# Altium schematic sheet Digital_Test.SchDoc
size 381 x 241 mm
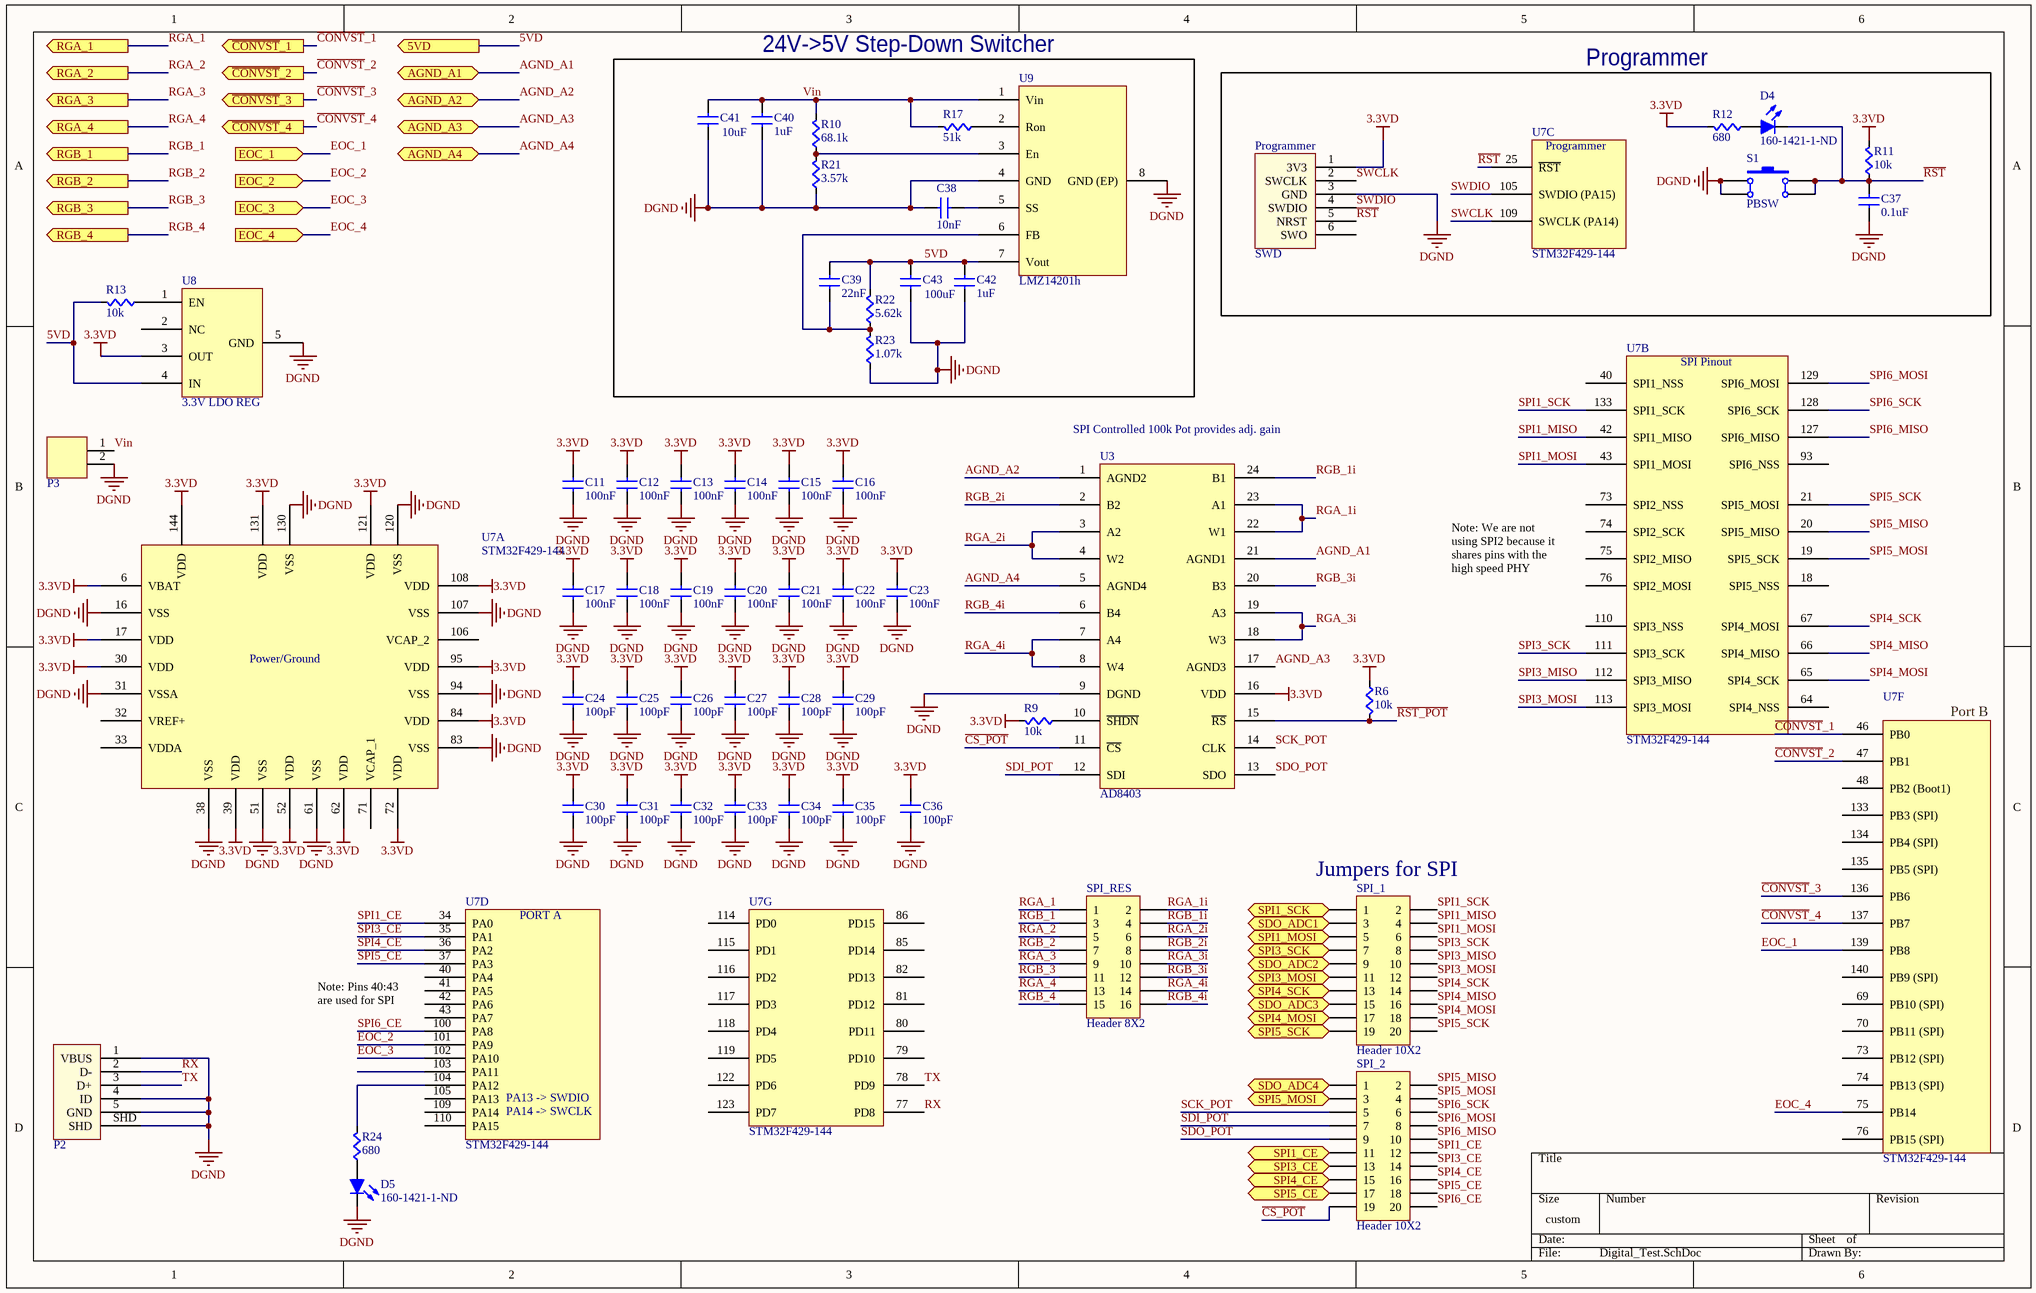
[diagram p0: Digital_Test.SchDoc]

## Parts
C11  value 100nF  [CAPC0603]  (hidden comment: Cap)
C12  value 100nF  [CAPC0603]  (hidden comment: Cap)
C13  value 100nF  [CAPC0603]  (hidden comment: Cap)
C14  value 100nF  [CAPC0603]  (hidden comment: Cap)
C15  value 100nF  [CAPC0603]  (hidden comment: Cap)
C16  value 100nF  [CAPC0603]  (hidden comment: Cap)
C17  value 100nF  [CAPC0603]  (hidden comment: Cap)
C18  value 100nF  [CAPC0603]  (hidden comment: Cap)
C19  value 100nF  [CAPC0603]  (hidden comment: Cap)
C20  value 100nF  [CAPC0603]  (hidden comment: Cap)
C21  value 100nF  [CAPC0603]  (hidden comment: Cap)
C22  value 100nF  [CAPC0603]  (hidden comment: Cap)
C23  value 100nF  [CAPC0603]  (hidden comment: Cap)
C24  value 100pF  [CAPC0603]  (hidden comment: Cap)
C25  value 100pF  [CAPC0603]  (hidden comment: Cap)
C26  value 100pF  [CAPC0603]  (hidden comment: Cap)
C27  value 100pF  [CAPC0603]  (hidden comment: Cap)
C28  value 100pF  [CAPC0603]  (hidden comment: Cap)
C29  value 100pF  [CAPC0603]  (hidden comment: Cap)
C30  value 100pF  [CAPC0603]  (hidden comment: Cap)
C31  value 100pF  [CAPC0603]  (hidden comment: Cap)
C32  value 100pF  [CAPC0603]  (hidden comment: Cap)
C33  value 100pF  [CAPC0603]  (hidden comment: Cap)
C34  value 100pF  [CAPC0603]  (hidden comment: Cap)
C35  value 100pF  [CAPC0603]  (hidden comment: Cap)
C36  value 100pF  [CAPC0603]  (hidden comment: Cap)
C37  value 0.1uF  [CAPC0603]  (hidden comment: Cap)
C38  value 10nF  [CAPC0603]  (hidden comment: Cap)
C39  value 22nF  [CAPC0603]  (hidden comment: Cap)
C40  value 1uF  [CAP1206]  (hidden comment: Cap1206)
C41  value 10uF  [CAP1210]  (hidden comment: CAP1210)
C42  value 1uF  [CAP1206]  (hidden comment: Cap1206)
C43  value 100uF  [CAP1210]  (hidden comment: CAP1210)
D4  Supplier Part Number: 160-1421-1-ND  [LED0805-RED]  (hidden comment: LED-RED)
D5  Supplier Part Number: 160-1421-1-ND  [LED0805-RED]  (hidden comment: LED-RED)
P2  USB Micro  [10118192-0001LF]  (value not drawn)
P3  2-pin Horz Sherlock  [MOLEX-HDR-1X2-SHERLOCK-HORZ]  (value not drawn)
Programmer  SWD  [SWD_STM32]
R6  value 10k  [RES0603]  (hidden comment: Res)
R9  value 10k  [RES0603]  (hidden comment: Res)
R10  value 68.1k  [RES0603]  (hidden comment: Res)
R11  value 10k  [RES0603]  (hidden comment: Res)
R12  value 680  [RES0603]  (hidden comment: Res)
R13  value 10k  [RES0603]  (hidden comment: Res)
R17  value 51k  [RES0603]  (hidden comment: Res)
R21  value 3.57k  [RES0603]  (hidden comment: Res)
R22  value 5.62k  [RES0603]  (hidden comment: Res)
R23  value 1.07k  [RES0603]  (hidden comment: Res)
R24  value 680  [RES0603]  (hidden comment: Res)
S1  PBSW  [PBSW]
SPI_1  Header 10X2  [HDR2X10]
SPI_2  Header 10X2  [HDR2X10]
SPI_RES  Header 8X2  [HDR2X8]
U3  AD8403  [SOIC-24n]
U7  STM32F429-144  [LQFP-144]  (parts A,B,C,D,F,G of 7)
U8  3.3V LDO REG  [SOT223-8N]
U9  LMZ14201h  [TO-PMOD-7]

## Blocks framed on the sheet
24V->5V Step-Down Switcher: C38-C43 R10 R17 R21-R23 U9
Programmer: C37 D4 Programmer R11 R12 S1 U7

## Ports
5VD (out), AGND_A1 (bidir), AGND_A2 (bidir), AGND_A3 (bidir), AGND_A4 (bidir), EOC_1 (in), EOC_2 (in), EOC_3 (in), EOC_4 (in), RGA_1 (out), RGA_2 (out), RGA_3 (out), RGA_4 (out), RGB_1 (out), RGB_2 (out), RGB_3 (out), RGB_4 (out), SDO_ADC1 (in), SDO_ADC2 (in), SDO_ADC3 (in), SDO_ADC4 (in), SPI1_CE (out), SPI1_MOSI (out), SPI1_SCK (bidir), SPI3_CE (out), SPI3_MOSI (out), SPI3_SCK (bidir), SPI4_CE (out), SPI4_MOSI (out), SPI4_SCK (bidir), SPI5_CE (out), SPI5_MOSI (out), SPI5_SCK (bidir), ~{CONVST}_1 (out), ~{CONVST}_2 (out), ~{CONVST}_3 (out), ~{CONVST}_4 (out)

## Nets
1: S1.2(A')
3: S1.4(B')
3.3VD: C11.1(A) C12.1(A) C13.1(A) C14.1(A) C15.1(A) C16.1(A) C17.1(A) C18.1(A) C19.1(A) C20.1(A) C21.1(A) C22.1(A) C23.1(A) C24.1(A) C25.1(A) C26.1(A) C27.1(A) C28.1(A) C29.1(A) C30.1(A) C31.1(A) C32.1(A) C33.1(A) C34.1(A) C35.1(A) C36.1(A) Programmer.1(3V3) R6.2(B) R9.1(A) R11.1(A) R12.1(A) U3.16(VDD) U7.6(VBAT) U7.17(VDD) U7.30(VDD) U7.39(VDD) U7.52(VDD) U7.62(VDD) U7.72(VDD) U7.84(VDD) U7.95(VDD) U7.108(VDD) U7.121(VDD) U7.131(VDD) U7.144(VDD) U8.3(OUT)
DGND: C11.2(B) C12.2(B) C13.2(B) C14.2(B) C15.2(B) C16.2(B) C17.2(B) C18.2(B) C19.2(B) C20.2(B) C21.2(B) C22.2(B) C23.2(B) C24.2(B) C25.2(B) C26.2(B) C27.2(B) C28.2(B) C29.2(B) C30.2(B) C31.2(B) C32.2(B) C33.2(B) C34.2(B) C35.2(B) C36.2(B) C37.2(B) C38.1(A) C40.2(B) C41.2(B) C42.2(B) C43.2(B) D5.1(K) P2.1(VBUS) P2.4(ID) P2.5(GND) P2.SHD P3.2 Programmer.3(GND) R21.2(B) R23.2(B) S1.1(A) S1.2(A') U3.9(DGND) U7.16(VSS) U7.31(VSSA) U7.38(VSS) U7.51(VSS) U7.61(VSS) U7.83(VSS) U7.94(VSS) U7.107(VSS) U7.120(VSS) U7.130(VSS) U8.5(GND) U9.4(GND) U9.8(GND_(EP))
5VD: C39.2(B) C42.1(A) C43.1(A) R13.1(A) R22.1(A) U8.4(IN) U9.7(Vout) ; port 5VD
AGND_A1: U3.21(AGND1) ; port AGND_A1
AGND_A2: U3.1(AGND2) ; port AGND_A2
AGND_A3: U3.17(AGND3) ; port AGND_A3
AGND_A4: U3.5(AGND4) ; port AGND_A4
~{CONVST}_1: U7.46(PB0) ; port ~{CONVST}_1
~{CONVST}_2: U7.47(PB1) ; port ~{CONVST}_2
~{CONVST}_3: U7.136(PB6) ; port ~{CONVST}_3
~{CONVST}_4: U7.137(PB7) ; port ~{CONVST}_4
~{CS_POT}: SPI_2.19 U3.11(~{CS})
EOC_1: U7.139(PB8) ; port EOC_1
EOC_2: U7.101(PA9) ; port EOC_2
EOC_3: U7.102(PA10) ; port EOC_3
EOC_4: U7.75(SPI2_MISO) ; port EOC_4
~{RST}: C37.1(A) D4.1(K) Programmer.5(NRST) R11.2(B) S1.3(B) S1.4(B') U7.25(~{RST})
~{RST_POT}: R6.1(A) U3.15(~{RS})
RGA_1: SPI_RES.1 ; port RGA_1
RGA_1i: SPI_RES.2 U3.22(W1) U3.23(A1)
RGA_2: SPI_RES.5 ; port RGA_2
RGA_2i: SPI_RES.6 U3.3(A2) U3.4(W2)
RGA_3: SPI_RES.9 ; port RGA_3
RGA_3i: SPI_RES.10 U3.18(W3) U3.19(A3)
RGA_4: SPI_RES.13 ; port RGA_4
RGA_4i: SPI_RES.14 U3.7(A4) U3.8(W4)
RGB_1: SPI_RES.3 ; port RGB_1
RGB_1i: SPI_RES.4 U3.24(B1)
RGB_2: SPI_RES.7 ; port RGB_2
RGB_2i: SPI_RES.8 U3.2(B2)
RGB_3: SPI_RES.11 ; port RGB_3
RGB_3i: SPI_RES.12 U3.20(B3)
RGB_4: SPI_RES.15 ; port RGB_4
RGB_4i: SPI_RES.16 U3.6(B4)
RX: P2.2(D-) U7.77(PD8)
SCK_POT: SPI_2.5 U3.14(CLK)
SDI_POT: SPI_2.7 U3.12(SDI)
SDO_ADC1: SPI_1.3 ; port SDO_ADC1
SDO_ADC2: SPI_1.9 ; port SDO_ADC2
SDO_ADC3: SPI_1.15 ; port SDO_ADC3
SDO_ADC4: SPI_2.1 ; port SDO_ADC4
SDO_POT: SPI_2.9 U3.13(SDO)
SPI1_CE: SPI_2.11 ; port SPI1_CE
SPI1_CE: SPI_2.12 U7.34(PA0)  [a separate net that carries the same name]
SPI1_MISO: SPI_1.4 U7.42(SPI1_MISO)
SPI1_MOSI: SPI_1.6 U7.43(SPI1_MOSI)
SPI1_MOSI: SPI_1.5 ; port SPI1_MOSI  [a separate net that carries the same name]
SPI1_SCK: SPI_1.2 U7.133(SPI1_SCK)
SPI1_SCK: SPI_1.1 ; port SPI1_SCK  [a separate net that carries the same name]
SPI3_CE: SPI_2.13 ; port SPI3_CE
SPI3_CE: SPI_2.14 U7.35(PA1)  [a separate net that carries the same name]
SPI3_MISO: SPI_1.10 U7.112(SPI3_MISO)
SPI3_MOSI: SPI_1.12 U7.113(SPI3_MOSI)
SPI3_MOSI: SPI_1.11 ; port SPI3_MOSI  [a separate net that carries the same name]
SPI3_SCK: SPI_1.8 U7.111(SPI3_SCK)
SPI3_SCK: SPI_1.7 ; port SPI3_SCK  [a separate net that carries the same name]
SPI4_CE: SPI_2.15 ; port SPI4_CE
SPI4_CE: SPI_2.16 U7.36(PA2)  [a separate net that carries the same name]
SPI4_MISO: SPI_1.16 U7.66(SPI4_MISO)
SPI4_MOSI: SPI_1.18 U7.65(SPI4_SCK)
SPI4_MOSI: SPI_1.17 ; port SPI4_MOSI  [a separate net that carries the same name]
SPI4_SCK: SPI_1.14 U7.67(SPI4_MOSI)
SPI4_SCK: SPI_1.13 ; port SPI4_SCK  [a separate net that carries the same name]
SPI5_CE: SPI_2.17 ; port SPI5_CE
SPI5_CE: SPI_2.18 U7.37(PA3)  [a separate net that carries the same name]
SPI5_MISO: SPI_2.2 U7.20(SPI5_MISO)
SPI5_MOSI: SPI_2.4 U7.19(SPI5_SCK)
SPI5_MOSI: SPI_2.3 ; port SPI5_MOSI  [a separate net that carries the same name]
SPI5_SCK: SPI_1.20 U7.21(SPI5_MOSI)
SPI5_SCK: SPI_1.19 ; port SPI5_SCK  [a separate net that carries the same name]
SPI6_CE: SPI_2.20 U7.100(PA8)
SPI6_MISO: SPI_2.10 U7.127(SPI6_MISO)
SPI6_MOSI: SPI_2.8 U7.129(SPI6_MOSI)
SPI6_SCK: SPI_2.6 U7.128(SPI6_SCK)
SWCLK: Programmer.2(SWCLK) U7.109(SWCLK_(PA14))
SWDIO: Programmer.4(SWDIO) U7.105(SWDIO_(PA15))
TX: P2.3(D+) U7.78(PD9)
Vin: C40.1(A) C41.1(A) P3.1 R10.1(A) R17.1(A) U9.1(Vin)
NetC38_2: C38.2(B) U9.5(SS)
NetC39_1: C39.1(A) R22.2(B) R23.1(A) U9.6(FB)
NetD4_2: D4.2(A) R12.2(B)
NetD5_2: D5.2(A) R24.2(B)
NetR9_2: R9.2(B) U3.10(~{SHDN})
NetR10_2: R10.2(B) R21.1(A) U9.3(En)
NetR13_2: R13.2(B) U8.1(EN)
NetR17_2: R17.2(B) U9.2(Ron)
NetR24_1: R24.1(A) U7.104(PA12)

Not connected (* = marked no-connect by the designer): Programmer 6(SWO); U7 18(SPI5_NSS) 32(VREF+) 33(VDDA) 40(SPI1_NSS) 41(PA5) 48(PB2_(Boot1)) 64(SPI4_NSS) 69(PB10_(SPI)) 70(PB11_(SPI)) 71(VCAP_1) 73(SPI2_NSS) 74(SPI2_SCK) 76(SPI2_MOSI) 79(PD10) 80(PD11) 81(PD12) 82(PD13) 85(PD14) 86(PD15) 93(SPI6_NSS) 103(PA11) 106(VCAP_2) 110(SPI3_NSS) 114(PD0) 115(PD1) 116(PD2) 117(PD3) 118(PD4) 119(PD5) 122(PD6) 123(PD7) 134(PB4_(SPI)) 135(PB5_(SPI)) 140(PB9_(SPI)); U8 2(NC)

## Notes on the sheet
- (near U3) SPI Controlled 100k Pot provides adj. gain
- Note: We are not using SPI2 because it shares pins with the high speed PHY
- (near SPI_1) Jumpers for SPI
- Note: Pins 40:43 are used for SPI
- (in symbol STM32F429-144, part A) Power/Ground
- (in symbol STM32F429-144, part B) SPI Pinout
- (in symbol STM32F429-144, part C) Programmer
- (in symbol STM32F429-144, part D) PORT A; PA13 -> SWDIO; PA14 -> SWCLK
- (in symbol STM32F429-144, part F) Port B

## Library data of the parts
C40 C42 = Cap1206: CAP CER 1UF 50V 10% X7R 1206; Supplier 1: Digi-Key; Supplier Part Number 1: 587-2230-1-ND
C41 C43 = CAP1210: CAP CER 10UF 50V 20% X5R 1210; Supplier 1: Digi-Key
  C41: Supplier Part Number 1: 587-2225-1-ND
  C43: Supplier Part Number 1: 587-1387-1-ND
D4 D5 = LED-RED: Light Emitting Diode - RED; Manufacturer Part Number: LTST-C171CKT; Manufacturer: Lite-On Inc; Voltage - Forward (Vf) Typ: 1.8V; Current - Test: 20mA; Millicandela Rating: 25mcd; Viewing Angle: 130°; Color: Red; Supplier: Digi-Key; Package / Case: 0805 (2012 Metric)
P2 = USB Micro: USB Mini B Metal Shield SMT; Supplier 1: Digi-Key; Supplier Part Number 1: 609-4613-1-ND
P3 = MOLEX-HDR-1x2-SHERLOCK_RA: Header, Molex, 2mm Pitch Sherlock Header, Single Row, Horizontal, 2 Circuits, Length 3.3mm,  0353630260; Manufacturer: Molex Inc; Manufacturer Part Number: 0353630260; Supplier Part Number 1: WM18931-ND; Supplier 1: Digi-Key
Programmer = SWD_STM32: SWD connector matching the pinout on STM Discovery Boards
S1 = SW-PB: Push Button Switch; Manufacturer: Panasonic Electronic Components; Manufacturer Part Number: EVQ-9P105M; Outline: 6.10mm x 6.00mm; Actuator Orientation: Top Actuated; Actuator Height off PCB, from Pins: 5.00mm; Published: 24-Mar-1999; LatestRevisionDate: 17-Jul-2002; LatestRevisionNote: Re-released for DXP Platform.; PackageReference: SPST-2; Publisher: Altium Limited; PackageDescription: Switch; 2 Leads; Supplier: Digi-Key; Supplier Part Number: P13586SCT-ND
SPI_1 SPI_2 = Header 10X2: Header, 10-Pin, Dual row; LatestRevisionDate: 17-Jul-2002; LatestRevisionNote: Re-released for DXP Platform.; Publisher: Altium Limited
SPI_RES = Header 8X2: Header, 8-Pin, Dual row; LatestRevisionDate: 17-Jul-2002; LatestRevisionNote: Re-released for DXP Platform.; Publisher: Altium Limited
U3 = AD8403: IC POT DGTL 8BIT 100K 4CH 24SOIC; Supplier 1: Digi-Key; Supplier Part Number 1: AD8403ARZ100-ND
U7 = STM32F429-144: IC MCU ARM 2MB FLASH 144LQFP; Supplier 1: Digi-Key; Supplier Part Number 1: 497-14053-ND
U8 = LP38691: IC REG LDO 3.3V 0.5A SOT223-5; Supplier 1: Digi-Key; Supplier Part Number 1: LP38693MP-3.3/NOPBCT-ND
U9 = LMZ14201h: IC BUCK SYNC ADJ 1A TO-PMOD-7; Supplier 1: Digi-Key; Supplier Part Number 1: LMZ14201HTZX/NOPBCT-ND
C11-C39 = Cap: Supplier 1: Digi-Key; Supplier Part Number 1: 1276-1000-1-ND
R6 R9-R13 R17 R21-R24 = Res: Supplier 1: Digi-Key; Supplier Part Number 1: RMCF0603JT10K0CT-ND